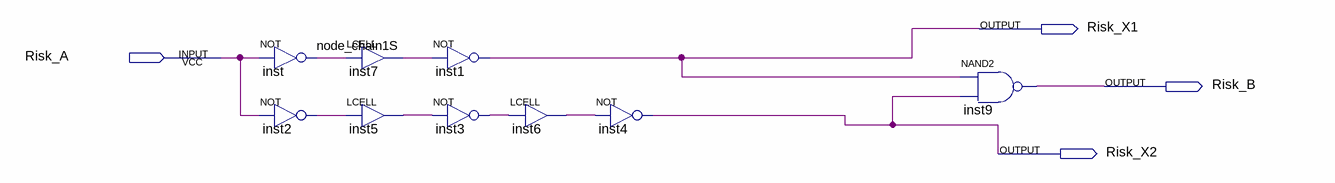
[diagram p0: schematic sheet]
// Quartus schematic Risk.bdf as structural Verilog: 9 symbols, 4 pins
module Risk (
  input  Risk_A,
  output Risk_X1,
  output Risk_B,
  output Risk_X2
);

  wire inst2_out, inst3_out, inst5_out, inst6_out, inst7_out, node_chain1S;

  not inst (node_chain1S, Risk_A);
  not inst2 (inst2_out, Risk_A);
  LCELL inst7 (.IN(node_chain1S), .OUT(inst7_out));
  LCELL inst5 (.IN(inst2_out), .OUT(inst5_out));
  not inst1 (Risk_X1, inst7_out);
  not inst3 (inst3_out, inst5_out);
  LCELL inst6 (.IN(inst3_out), .OUT(inst6_out));
  not inst4 (Risk_X2, inst6_out);
  nand inst9 (Risk_B, Risk_X1, Risk_X2);
endmodule
